# EAGLE design SAOP (EAGLE 9.6.2)
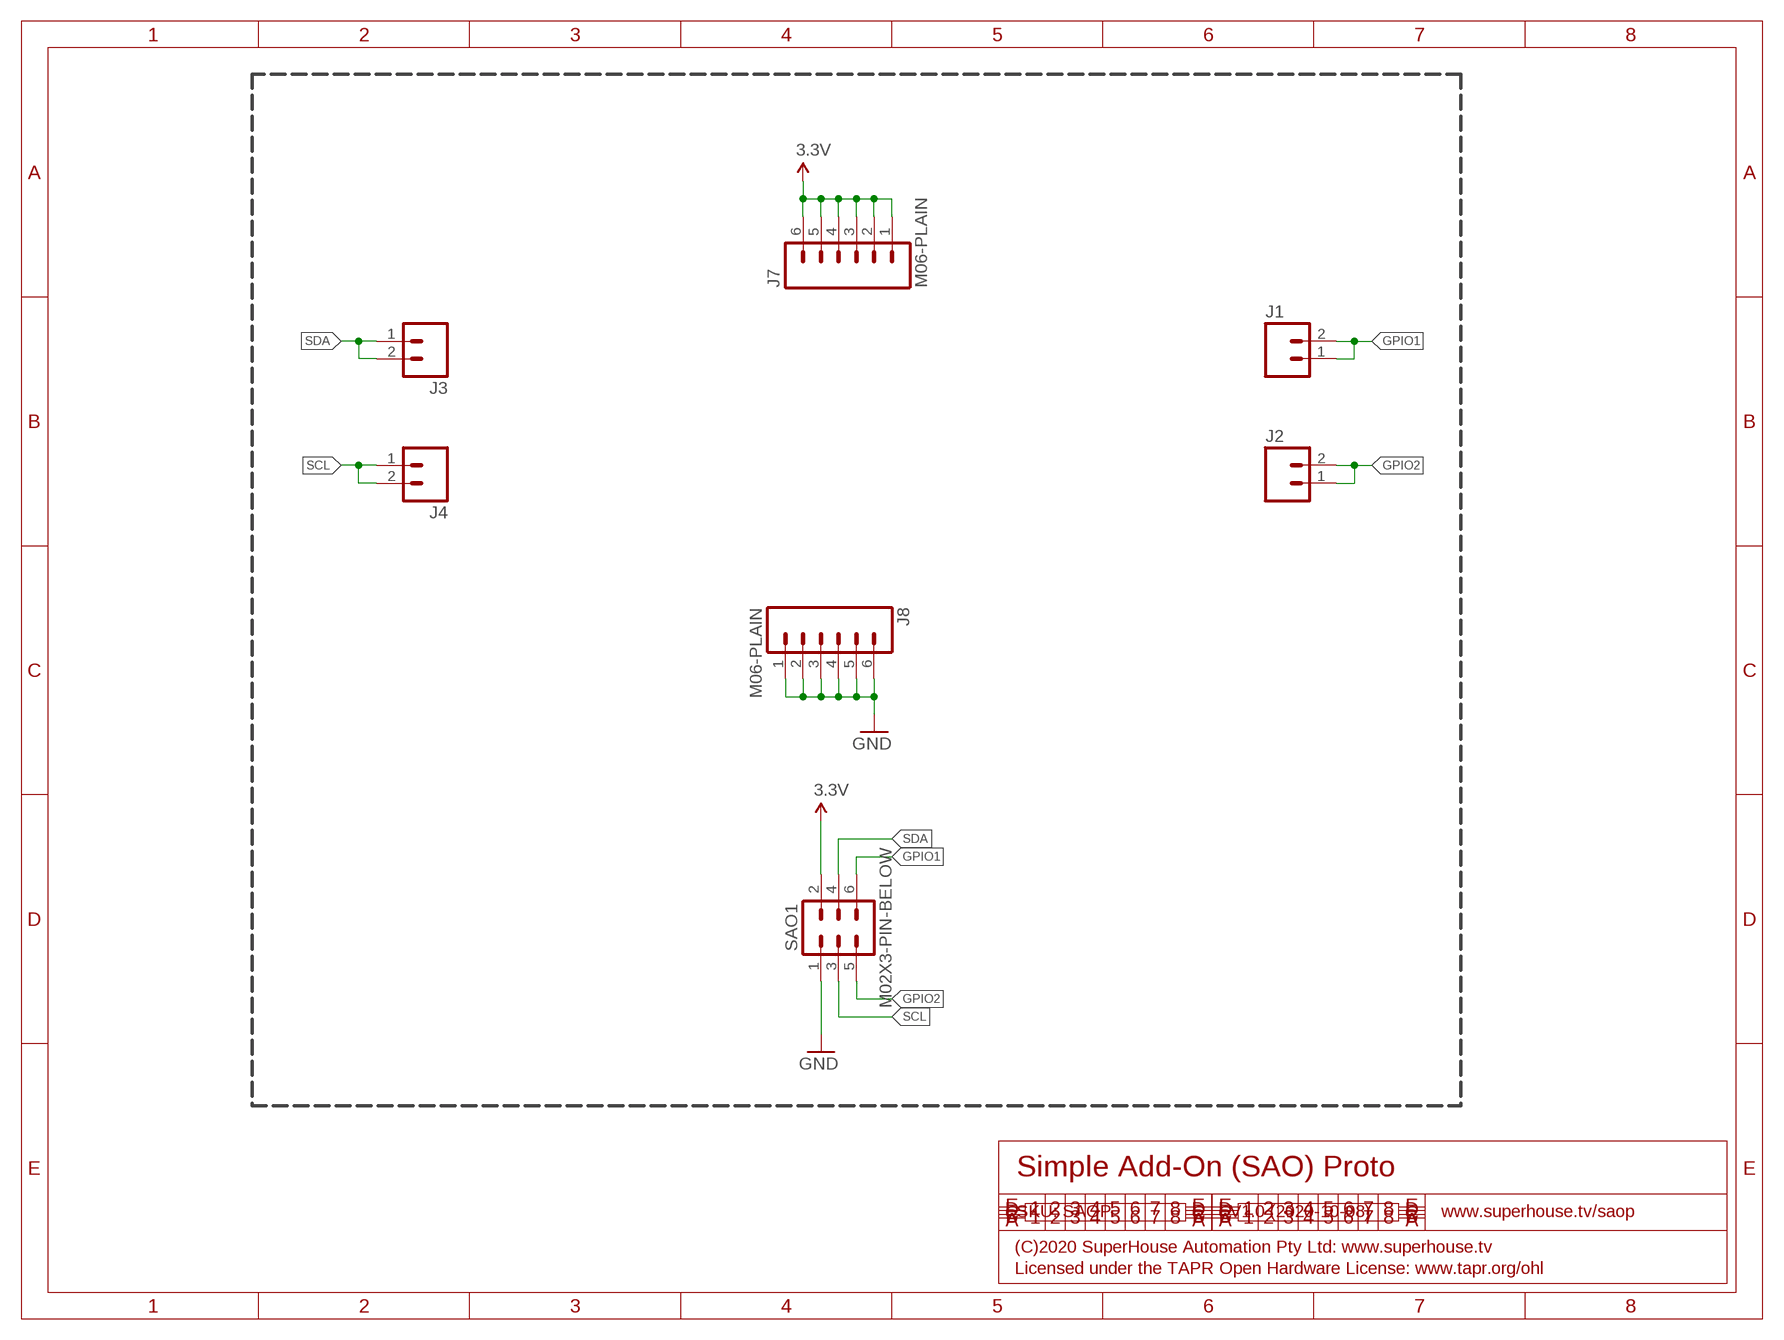
[diagram p0: schematic, sheet 1]

## Parts
J1  M02-PLAIN  [1X02]
J2  M02-PLAIN  [1X02]
J3  M02-PLAIN  [1X02]
J4  M02-PLAIN  [1X02]
J7  M06-PLAIN  [1X06]
J8  M06-PLAIN  [1X06]
SAO1  M02X3-PIN-BELOW  [2X03-P-BELOW]

## Nets
3.3V: J7.1 J7.2 J7.3 J7.4 J7.5 J7.6 SAO1.2
GND: J8.1 J8.2 J8.3 J8.4 J8.5 J8.6 SAO1.1
GPIO1: J1.1 J1.2 SAO1.6
GPIO2: J2.1 J2.2 SAO1.5
SCL: J4.1 J4.2 SAO1.3
SDA: J3.1 J3.2 SAO1.4

## Notes on the sheet
- Simple Add-On (SAO) Proto
- SKU: SAOP | V1.0 (2020-10-08) | www.superhouse.tv/saop
- (C)2020 SuperHouse Automation Pty Ltd: www.superhouse.tv
- Licensed under the TAPR Open Hardware License: www.tapr.org/ohl

## Library data of the parts
J1-J4 = SuperHouse-Connectors:M02: 2-way header Standard 1x2 header, and screw terminal variations
J7 J8 = SuperHouse-Connectors:M06: 6-way header Standard 1x6 header, and screw terminal variations
SAO1 = SuperHouse-Connectors:M02X3: M6 header in 2x3 format

## Net classes
0 default: width 0.203 mm, drill 0.356 mm, clearance 0.152 mm
1 power: width 0.203 mm, clearance 0.152 mm

## Board
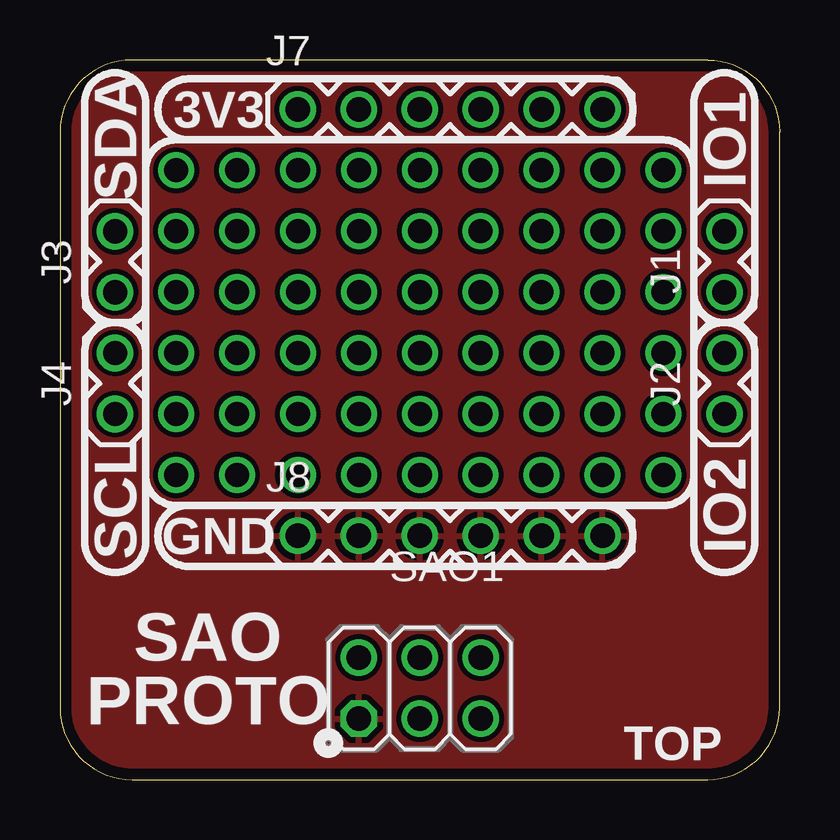
[diagram p1: board, top side]
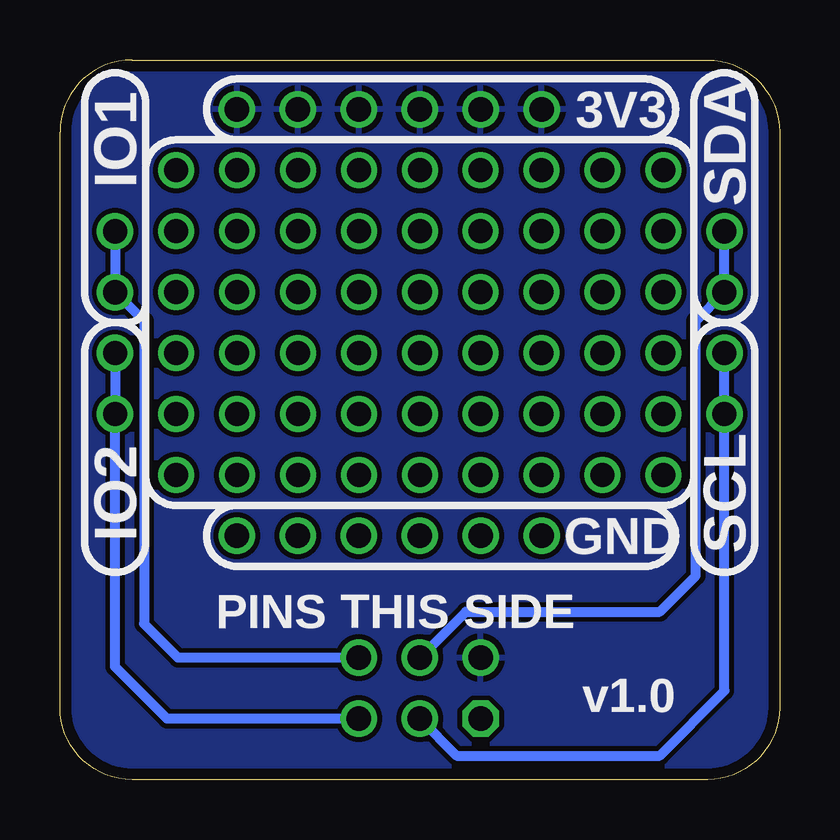
[diagram p2: board, bottom side, seen from below]

Size 30 x 30 mm. Coordinates in mm from the lower left corner, seen from the top.
Outline: 3,0 27,0 arc90 30,3 30,27 arc90 27,30 3,30 arc90 0,27 0,3 arc90 3,0
Copper layers (1*16): Top 0.035mm / dielectric 1.5mm / Bottom 0.035mm
Design rules "SuperHouse-Design-Rules": minimum track width 10mil, minimum drill 24mil, track to track 8mil, track to pad 8mil, pad to pad 8mil, via to via 8mil, smd to smd 6mil, copper to edge 18mil, drill to drill 8mil, minimum pad ring 7mil, minimum via ring 8mil, stop-mask expansion 4mil, vias tented up to drill 0.5mm, thermal gap 10mil

### Footprints (pad centres in the part's own frame; a part is rotated, then mirrored left to right if it is on the bottom)
1X02 = drill 1.016: 1 -1.27,0; 2 1.27,0
1X06 = drill 1.016: 1 -6.35,0; 2 -3.81,0; 3 -1.27,0; 4 1.27,0; 5 3.81,0; 6 6.35,0
2X03-P-BELOW = drill 1.016 octagon: 1 -2.54,-1.27 | drill 1.016: 2 -2.54,1.27; 3 0,-1.27; 4 0,1.27; 5 2.54,-1.27; 6 2.54,1.27

### Placement (x,y rotation side)
J1  27.7,21.59 90 top
J2  27.7,16.51 90 top
J3  2.3,21.59 90 top
J4  2.3,16.51 90 top
J7  16.27,27.94 0 top
J8  16.27,10.16 0 top
SAO1  15,3.81 0 top

### Tracks (layer width: path | path; a pad name or v marks a point on that pad's centre or on a via)
3.3V
  pour Bottom: 3,0 arc-90 0,3 0,27 arc-90 3,30 27,30 arc-90 30,27 30,3 arc-90 27,0
GND
  pour Top: 27,0 3,0 arc-90 0,3 0,27 arc-90 3,30 27,30 arc-90 30,27 30,3 arc-90
GPIO1
  Bottom 0.406: SAO1.6 25.08,5.08 26.5,6.5 26.5,19.12 J1.1 J1.2
GPIO2
  Bottom 0.406: SAO1.5 25.54,2.54 27.7,4.7 J2.1 J2.2
N$1  (via drill 1)
  other vias: 7.38,17.78
N$2  (via drill 1)
  other vias: 9.92,15.24
N$3  (via drill 1)
  other vias: 9.92,17.78
N$4  (via drill 1)
  other vias: 7.38,15.24
N$5  (via drill 1)
  other vias: 4.84,15.24
N$6  (via drill 1)
  other vias: 4.84,17.78
N$7  (via drill 1)
  other vias: 4.84,20.32
N$8  (via drill 1)
  other vias: 7.38,20.32
N$9  (via drill 1)
  other vias: 4.84,22.86
N$10  (via drill 1)
  other vias: 7.38,22.86
N$11  (via drill 1)
  other vias: 9.92,20.32
N$12  (via drill 1)
  other vias: 9.92,22.86
N$13  (via drill 1)
  other vias: 4.84,12.7
N$14  (via drill 1)
  other vias: 7.38,12.7
N$15  (via drill 1)
  other vias: 9.92,12.7
N$16  (via drill 1)
  other vias: 4.84,25.4
N$17  (via drill 1)
  other vias: 7.38,25.4
N$18  (via drill 1)
  other vias: 9.92,25.4
N$19  (via drill 1)
  other vias: 12.46,15.24
N$20  (via drill 1)
  other vias: 15,15.24
N$21  (via drill 1)
  other vias: 12.46,17.78
N$22  (via drill 1)
  other vias: 15,17.78
N$23  (via drill 1)
  other vias: 17.54,15.24
N$24  (via drill 1)
  other vias: 17.54,17.78
N$25  (via drill 1)
  other vias: 12.46,20.32
N$26  (via drill 1)
  other vias: 15,20.32
N$27  (via drill 1)
  other vias: 12.46,22.86
N$28  (via drill 1)
  other vias: 15,22.86
N$29  (via drill 1)
  other vias: 17.54,20.32
N$30  (via drill 1)
  other vias: 17.54,22.86
N$31  (via drill 1)
  other vias: 12.46,12.7
N$32  (via drill 1)
  other vias: 15,12.7
N$33  (via drill 1)
  other vias: 17.54,12.7
N$34  (via drill 1)
  other vias: 12.46,25.4
N$35  (via drill 1)
  other vias: 15,25.4
N$36  (via drill 1)
  other vias: 17.54,25.4
N$37  (via drill 1)
  other vias: 20.08,15.24
N$38  (via drill 1)
  other vias: 22.62,15.24
N$39  (via drill 1)
  other vias: 20.08,17.78
N$40  (via drill 1)
  other vias: 22.62,17.78
N$41  (via drill 1)
  other vias: 25.16,15.24
N$42  (via drill 1)
  other vias: 25.16,17.78
N$43  (via drill 1)
  other vias: 20.08,20.32
N$44  (via drill 1)
  other vias: 22.62,20.32
N$45  (via drill 1)
  other vias: 20.08,22.86
N$46  (via drill 1)
  other vias: 22.62,22.86
N$47  (via drill 1)
  other vias: 25.16,20.32
N$48  (via drill 1)
  other vias: 25.16,22.86
N$49  (via drill 1)
  other vias: 20.08,12.7
N$50  (via drill 1)
  other vias: 22.62,12.7
N$51  (via drill 1)
  other vias: 25.16,12.7
N$52  (via drill 1)
  other vias: 20.08,25.4
N$53  (via drill 1)
  other vias: 22.62,25.4
N$54  (via drill 1)
  other vias: 25.16,25.4
SCL
  Bottom 0.406: SAO1.3 13.46,1 5,1 2.3,3.7 J4.1 J4.2
SDA
  Bottom 0.406: SAO1.4 13.08,7 5,7 3.5,8.5 3.5,19.12 J3.1 J3.2

### Text on the board
tPlace: 3V3 | SDA | IO1 | SCL | IO2 | GND | SAO / PROTO | TOP
bPlace: 3V3 | SDA | IO1 | SCL | IO2 | GND | PINS THIS SIDE | v1.0